# EAGLE design reflowserial (EAGLE 7.6.0)
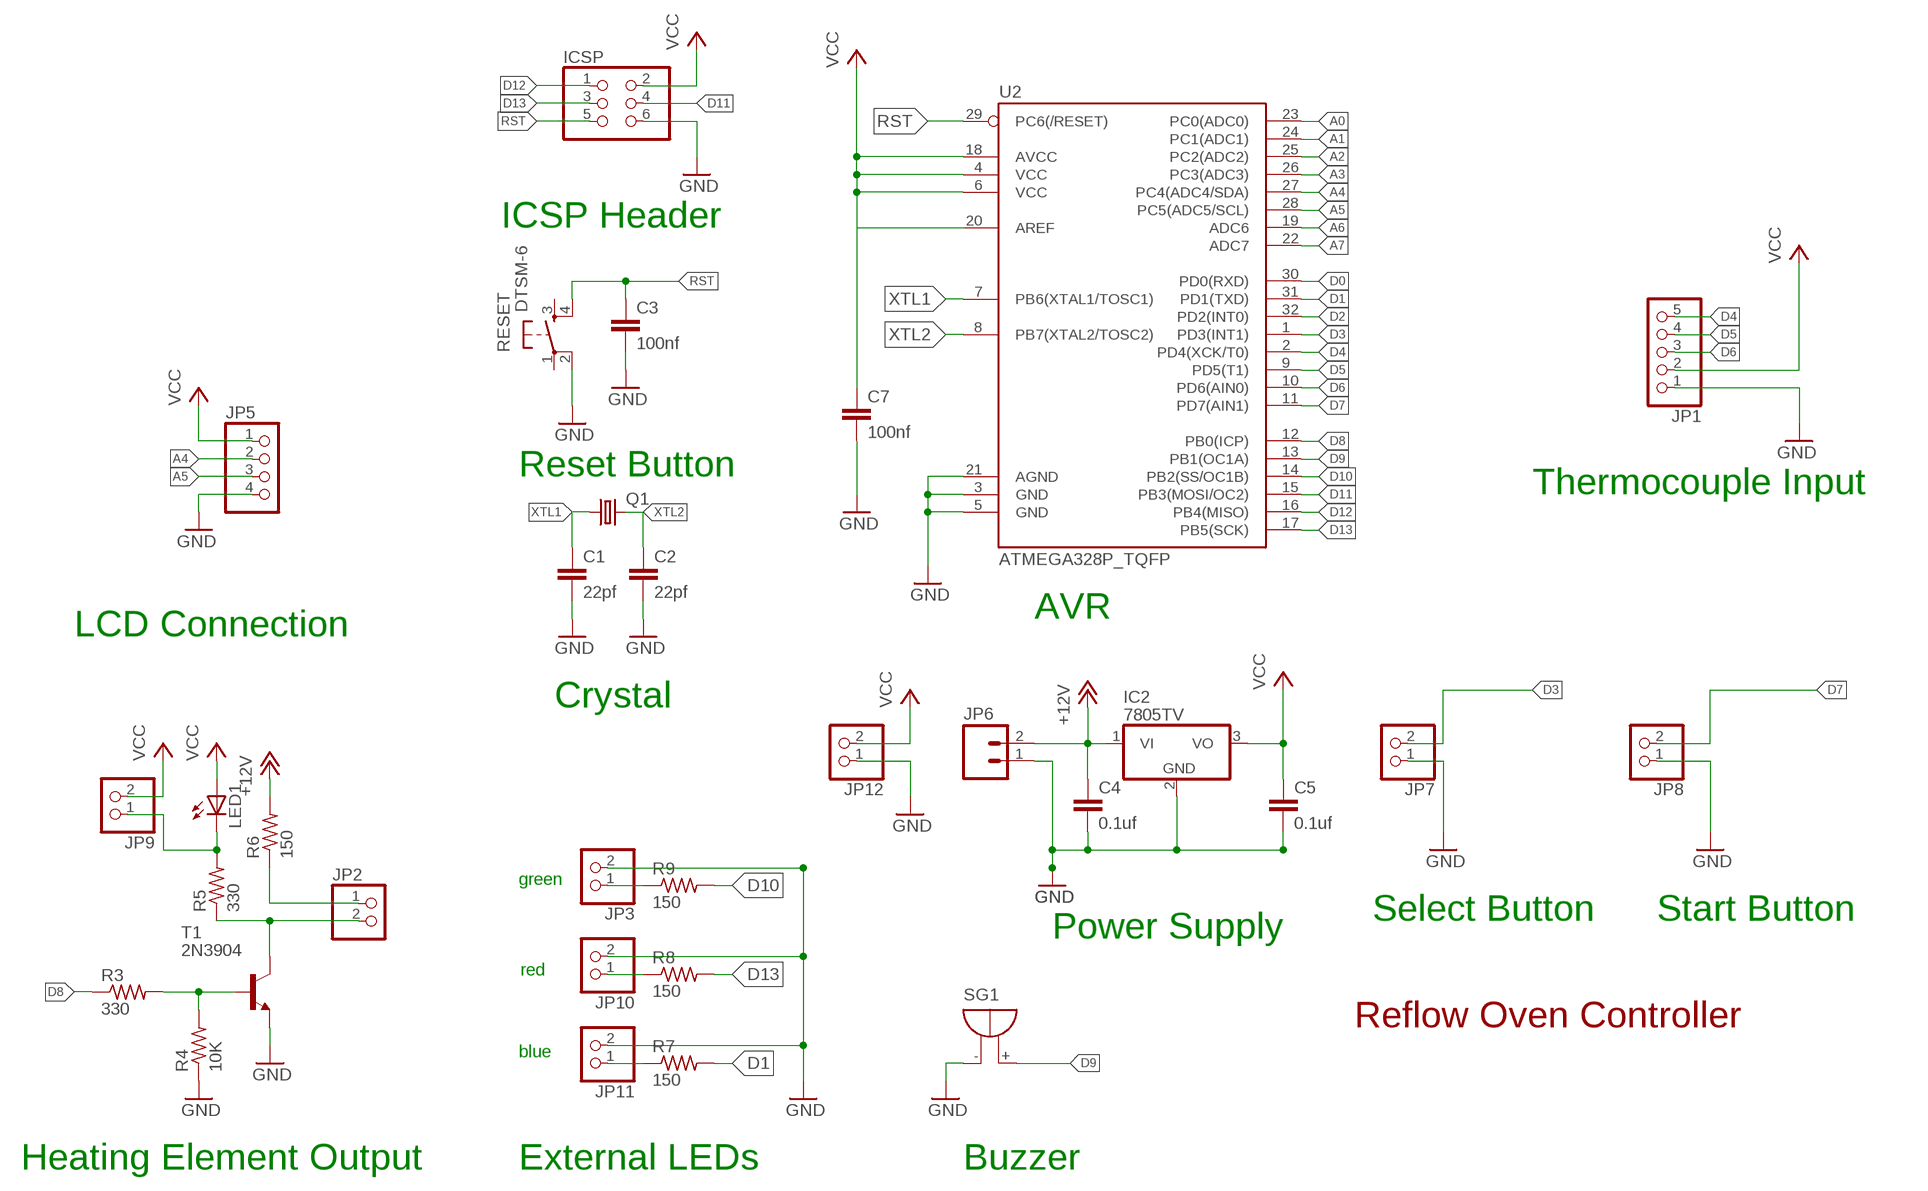
[diagram p0: schematic, sheet 1]

## Parts
C1  22pf  C-EUC0805  [C0805]
C2  22pf  C-EUC0805  [C0805]
C3  100nf  C-EUC0805  [C0805]
C4  0.1uf  C-EUC0805  [C0805]
C5  0.1uf  C-EUC0805  [C0805]
C7  100nf  C-EUC0805  [C0805]
IC2  7805TV  [TO220V]
ICSP  PINHD-2X3  [2X03]
JP1  PINHD-1X5  [1X05]
JP2  PINHD-1X2  [1X02]
JP3  PINHD-1X2  [1X02]
JP5  PINHD-1X4  [1X04]
JP6  M023.5MM  [SCREWTERMINAL-3.5MM-2]
JP7  PINHD-1X2  [1X02]
JP8  PINHD-1X2  [1X02]
JP9  PINHD-1X2  [1X02]
JP10  PINHD-1X2  [1X02]
JP11  PINHD-1X2  [1X02]
JP12  PINHD-1X2  [1X02]
LED1  LEDSMT1206  [1206]
Q1  CRYSTALSM49  [SM49]
R3  330  R-US_R0805  [R0805]
R4  10K  R-US_R0805  [R0805]
R5  330  R-US_R0805  [R0805]
R6  150  R-US_R0805  [R0805]
R7  150  R-US_R0805  [R0805]
R8  150  R-US_R0805  [R0805]
R9  150  R-US_R0805  [R0805]
RESET  DTSM-6  [DTSM-6]
SG1  F/QMBIII  [F/QMBIII]
T1  2N3904  [TO92@1]
U2  ATMEGA328P_TQFP  [TQFP32-08]

## Nets
+12V: C4.1 IC2.1(VI) JP6.2 R6.2
A0: U2.23(PC0(ADC0))
A1: U2.24(PC1(ADC1))
A2: U2.25(PC2(ADC2))
A3: U2.26(PC3(ADC3))
A4: JP5.2 U2.27(PC4(ADC4/SDA))
A5: JP5.3 U2.28(PC5(ADC5/SCL))
A6: U2.19(ADC6)
A7: U2.22(ADC7)
D0: U2.30(PD0(RXD))
D1: R7.2 U2.31(PD1(TXD))
D2: U2.32(PD2(INT0))
D3: JP7.2 U2.1(PD3(INT1))
D4: JP1.5 U2.2(PD4(XCK/T0))
D5: JP1.4 U2.9(PD5(T1))
D6: JP1.3 U2.10(PD6(AIN0))
D7: JP8.2 U2.11(PD7(AIN1))
D8: R3.1 U2.12(PB0(ICP))
D9: SG1.+(-) U2.13(PB1(OC1A))
D10: R9.2 U2.14(PB2(SS/OC1B))
D11: ICSP.4 U2.15(PB3(MOSI/OC2))
D12: ICSP.1 U2.16(PB4(MISO))
D13: ICSP.3 R8.2 U2.17(PB5(SCK))
GND: C1.2 C2.2 C3.2 C4.2 C5.2 C7.2 IC2.2(GND) ICSP.6 JP1.1 JP3.2 JP5.4 JP6.1 JP7.1 JP8.1 JP10.2 JP11.2 JP12.1 R4.1 RESET.2 SG1.-(+) T1.3(E) U2.3(GND) U2.5(GND) U2.21(AGND)
N$1: JP3.1 R9.1
N$2: R3.2 R4.2 T1.2(B)
N$3: JP2.2 R5.1 T1.1(C)
N$4: JP10.1 R8.1
N$5: JP11.1 R7.1
N$6: JP9.1 LED1.C R5.2
N$7: JP2.1 R6.1
RST: C3.1 ICSP.5 RESET.4 U2.29(PC6(/RESET))
VCC: C5.1 C7.1 IC2.3(VO) ICSP.2 JP1.2 JP5.1 JP9.2 JP12.2 LED1.A U2.4(VCC) U2.6(VCC) U2.18(AVCC) U2.20(AREF)
XTL1: C1.1 Q1.1 U2.7(PB6(XTAL1/TOSC1))
XTL2: C2.1 Q1.2 U2.8(PB7(XTAL2/TOSC2))
Unconnected: RESET.1 RESET.3

## Notes on the sheet
- ICSP Header
- Reset Button
- Thermocouple Input
- AVR
- LCD Connection
- Crystal
- green
- Select Button | Start Button
- Power Supply
- red
- Reflow Oven Controller
- blue
- Heating Element Output | External LEDs | Buzzer

## Library data of the parts
C1-C5 C7 = resistor:C-EU: CAPACITOR, European symbol
IC2 = linear:78*: Positive VOLTAGE REGULATOR Source: http://cache.national.com/ds/LM/LM78L05.pdf http://www.fairchildsemi.com/ds/LM/LM7805.pdf
ICSP = pinhead:PINHD-2X3: PIN HEADER
JP1 = pinhead:PINHD-1X5: PIN HEADER
JP2 JP3 JP7-JP12 = pinhead:PINHD-1X2: PIN HEADER
JP5 = pinhead:PINHD-1X4: PIN HEADER
JP6 = SparkFun-Connectors:M02: Standard 2-pin 0.1" header. Use with - straight break away headers ( PRT-00116) - right angle break away headers (PRT-00553) - swiss pins (PRT-00743) - machine pins (PRT-00117) - female headers (PRT-00115) Molex polarized connector foot print use with: PRT-08233 with associated crimp pins and housings. 2.54_SCREWTERM for use with PRT-10571. 3.5mm Screw Terminal footprints for PRT-08084 5mm Screw Terminal footprints for use with PRT-08433
LED1 = led:LED: LED OSRAM: - CHIPLED LG R971, LG N971, LY N971, LG Q971, LY Q971, LO R971, LY R971 LH N974, LH R974 LS Q976, LO Q976, LY Q976 LO Q996 - Hyper CHIPLED LW Q18S LB Q993, LB Q99A, LB R99A - SideLED LS A670, LO A670, LY A670, LG A670, LP A670 LB A673, LV A673, LT A673, LW A673 LH A674 LY A675 LS A676, LA A676, LO A676, LY A676, LW A676 LS A679, LY A679, LG A679 - Hyper Micro SIDELED® LS Y876, LA Y876, LO Y876, LY Y876 LT Y87S - SmartLED LW L88C, LW L88S LB L89C, LB L89S, LG L890 LS L89K, LO L89K, LY L89K LS L896, LA L896, LO L896, LY L896 - TOPLED LS T670, LO T670, LY T670, LG T670, LP T670 LSG T670, LSP T670, LSY T670, LOP T670, LYG T670 LG T671, LOG T671, LSG T671 LB T673, LV T673, LT T673, LW T673 LH T674 LS T676, LA T676, LO T676, LY T676, LB T676, LH T676, LSB T676, LW T676 LB T67C, LV T67C, LT T67C, LS T67K, LO T67K, LY T67K, LW E67C LS E67B, LA E67B, LO E67B, LY E67B, LB E67C, LV E67C, LT E67C LW T67C LS T679, LY T679, LG T679 LS T770, LO T770, LY T770, LG T770, LP T770 LB T773, LV T773, LT T773, LW T773 LH T774 LS E675, LA E675, LY E675, LS T675 LS T776, LA T776, LO T776, LY T776, LB T776 LHGB T686 LT T68C, LB T68C - Hyper Mini TOPLED® LB M676 - Mini TOPLED Santana® LG M470 LS M47K, LO M47K, LY M47K Source: http://www.osram.convergy.de LUXEON: - LUMILED® LXK2-PW12-R00, LXK2-PW12-S00, LXK2-PW14-U00, LXK2-PW14-V00 LXK2-PM12-R00, LXK2-PM12-S00, LXK2-PM14-U00 LXK2-PE12-Q00, LXK2-PE12-R00, LXK2-PE12-S00, LXK2-PE14-T00, LXK2-PE14-U00 LXK2-PB12-K00, LXK2-PB12-L00, LXK2-PB12-M00, LXK2-PB14-N00, LXK2-PB14-P00, LXK2-PB14-Q00 LXK2-PR12-L00, LXK2-PR12-M00, LXK2-PR14-Q00, LXK2-PR14-R00 LXK2-PD12-Q00, LXK2-PD12-R00, LXK2-PD12-S00 LXK2-PH12-R00, LXK2-PH12-S00 LXK2-PL12-P00, LXK2-PL12-Q00, LXK2-PL12-R00 Source: www.luxeon.com KINGBRIGHT: KA-3528ASYC Source: www.kingbright.com
Q1 = crystal:CRYSTAL: CRYSTAL; OC_FARNELL: unknown; OC_NEWARK: unknown
R3-R9 = resistor:R-US_: RESISTOR, American symbol
RESET = switch-tact:DTSM-6
SG1 = buzzer:F/QMBIII: BUZZER Source: Buerklin; OC_FARNELL: unknown; OC_NEWARK: unknown
T1 = transistor:2N3904: NPN TRANSISTOR
U2 = SparkFun-DigitalIC:ATMEGA328P_TQFP; PROD_ID: IC-09069

## Board
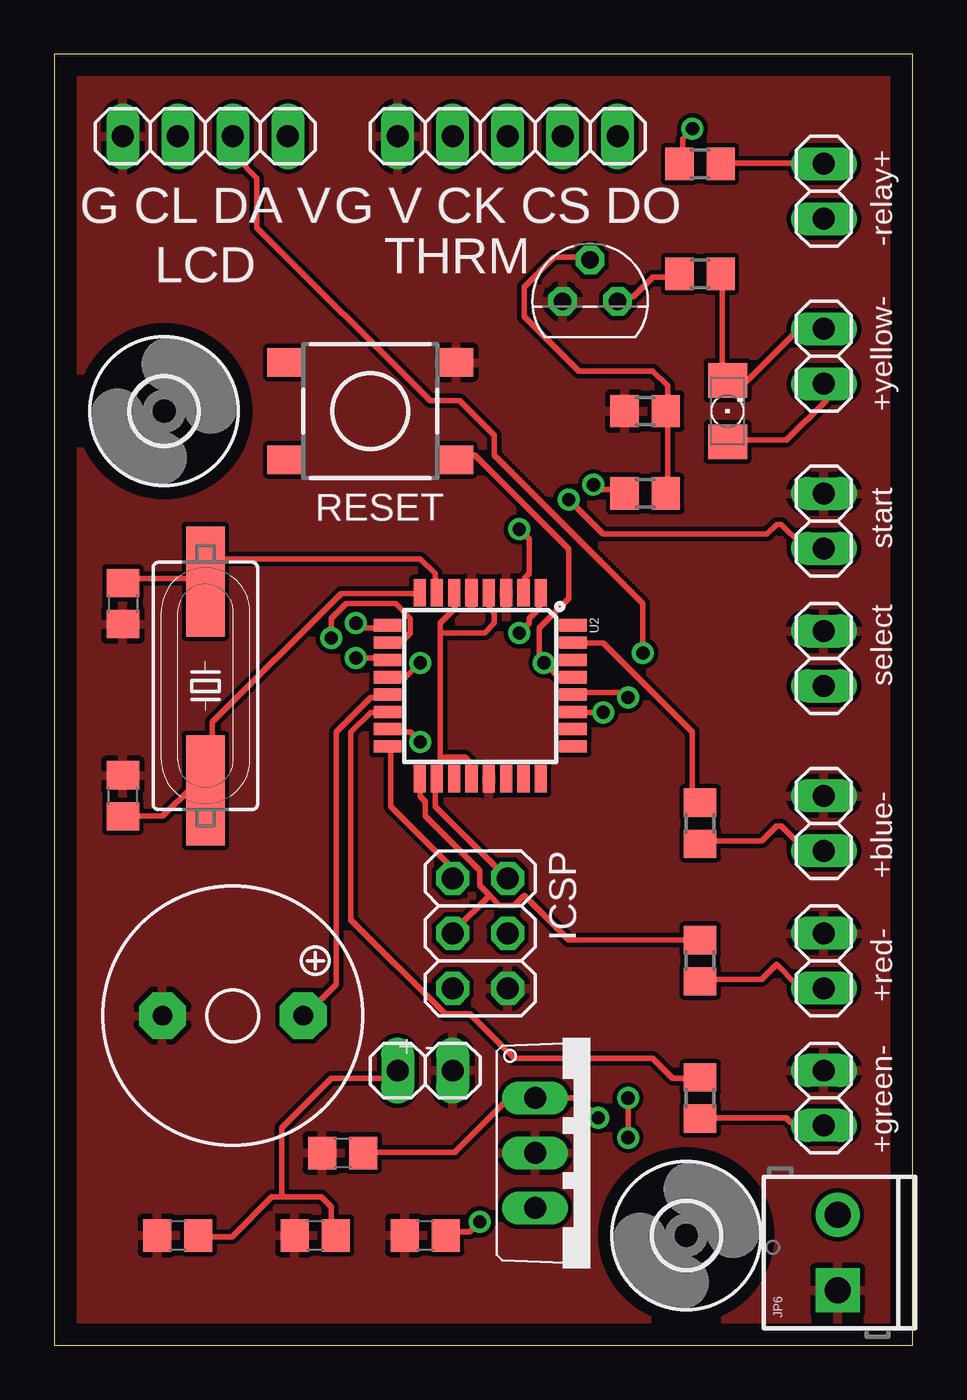
[diagram p1: board, top side]
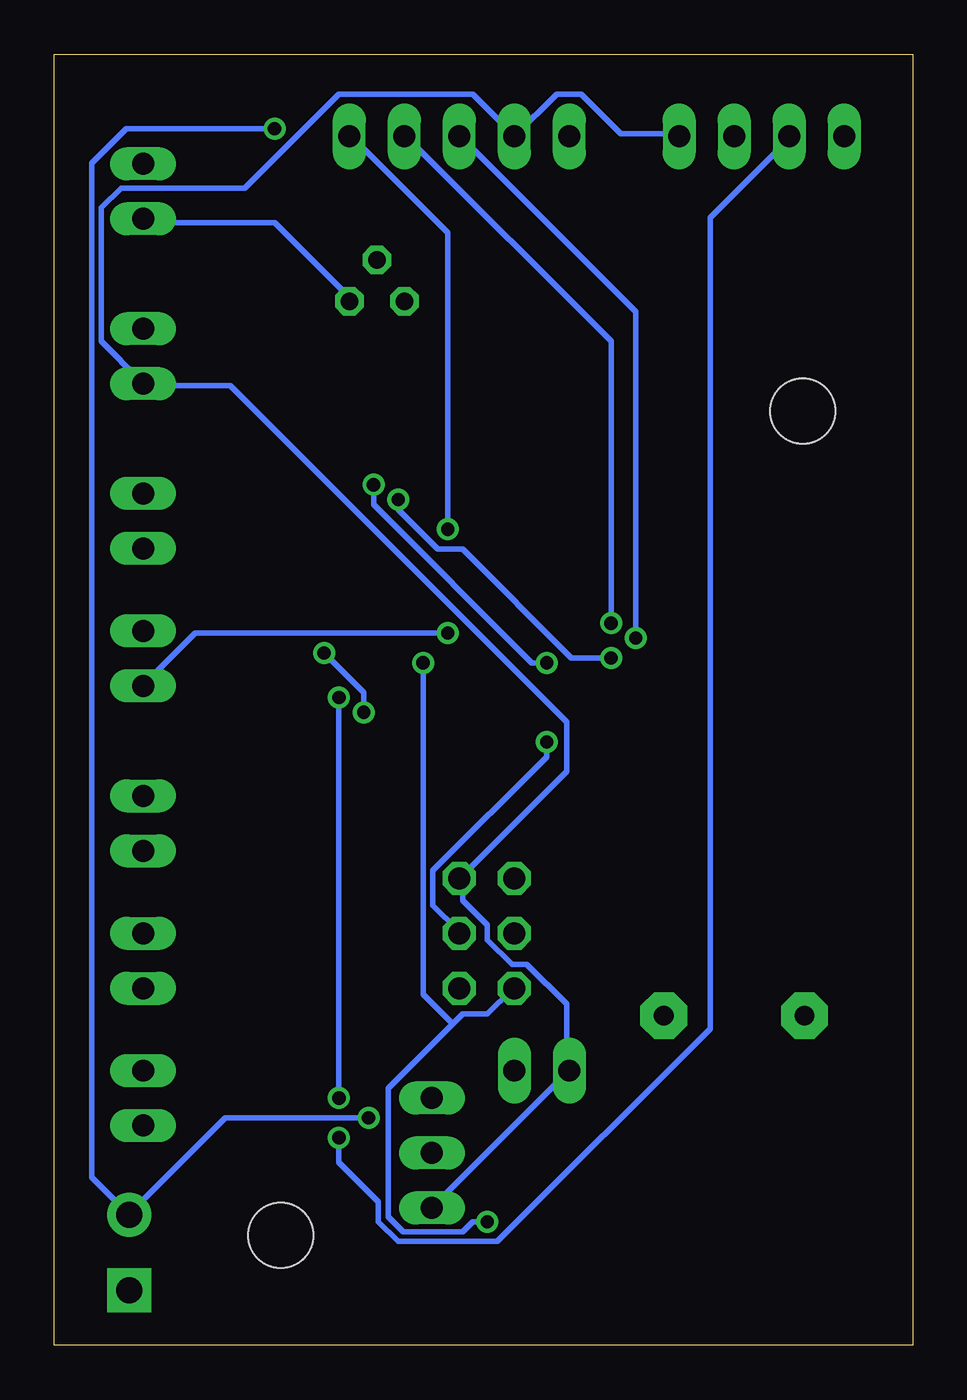
[diagram p2: board, bottom side, seen from below]

Size 39.67 x 59.68 mm. Coordinates in mm from the lower left corner, seen from the top.
Outline: 0,0 39.67,0 39.67,59.68 0,59.68 0,0
Copper layers (1*16): Top 0.035mm / dielectric 1.5mm / Bottom 0.035mm
Design rules "default": minimum track width 10mil, minimum drill 24mil, track to track 8mil, track to pad 8mil, pad to pad 8mil, via to via 8mil, smd to smd 8mil, copper to edge 40mil, drill to drill 8mil, minimum pad ring 10mil, minimum via ring 8mil, stop-mask expansion 4mil, vias tented up to drill 0mil, thermal gap 10mil

### Footprints (pad centres in the part's own frame; a part is rotated, then mirrored left to right if it is on the bottom)
C0805 = smd 1.3 x 1.5: 1 -0.95,0; 2 0.95,0
TO220V = drill 1.016 long: 1 -2.54,-2.54; 2 0,-2.54; 3 2.54,-2.54
2X03 = drill 1.016 octagon: 1 -2.54,-1.27; 2 -2.54,1.27; 3 0,-1.27; 4 0,1.27; 5 2.54,-1.27; 6 2.54,1.27
1X05 = drill 1.016 long: 1 -5.08,0; 2 -2.54,0; 3 0,0; 4 2.54,0; 5 5.08,0
1X02 = drill 1.016 long: 1 -1.27,0; 2 1.27,0
1X04 = drill 1.016 long: 1 -3.81,0; 2 -1.27,0; 3 1.27,0; 4 3.81,0
SCREWTERMINAL-3.5MM-2 = drill 1.2 pad 2.032 square: 1 0,0 | drill 1.2 pad 2.032: 2 3.5,0
1206 = smd 1.6 x 1.803: A -1.422,0; C 1.422,0
SM49 = smd 5.08 x 1.778: 1 -4.826,0; 2 4.826,0
R0805 = smd 1.3 x 1.5: 1 -0.95,0; 2 0.95,0
DTSM-6 = smd 1.55 x 1.3: 1 -3.975,2.25; 2 3.975,2.25; 3 -3.975,-2.25; 4 3.975,-2.25
F/QMBIII = drill 0.914 pad 2.159 octagon: + 3.251,0; - -3.251,0
TO92@1 = drill 0.813 octagon: 1 1.27,0; 2 0,1.905; 3 -1.27,0
TQFP32-08 = smd 1.27 x 0.559: 1 -4.293,2.8; 2 -4.293,2; 3 -4.293,1.2; 4 -4.293,0.4; 5 -4.293,-0.4; 6 -4.293,-1.2; 7 -4.293,-2; 8 -4.293,-2.8; 17 4.293,-2.8; 18 4.293,-2; 19 4.293,-1.2; 20 4.293,-0.4; 21 4.293,0.4; 22 4.293,1.2; 23 4.293,2; 24 4.293,2.8 | smd 0.559 x 1.27: 9 -2.8,-4.293; 10 -2,-4.293; 11 -1.2,-4.293; 12 -0.4,-4.293; 13 0.4,-4.293; 14 1.2,-4.293; 15 2,-4.293; 16 2.8,-4.293; 25 2.8,4.293; 26 2,4.293; 27 1.2,4.293; 28 0.4,4.293; 29 -0.4,4.293; 30 -1.2,4.293; 31 -2,4.293; 32 -2.8,4.293
3,0 = hole 3: 0,0

### Placement (x,y rotation side)
C1  3.17,34.29 270 top
C2  3.17,25.4 90 top
C3  17.14,5.08 180 top
C4  13.34,8.89 180 top
C5  5.71,5.08 180 top
C7  12.06,5.08 180 top
IC2  24.77,8.89 270 top
ICSP  19.68,19.05 270 top
JP1  20.95,55.88 0 top
JP2  35.56,53.34 270 top
JP3  35.56,11.43 90 top
JP5  6.99,55.88 180 top
JP6  36.2,2.54 90 top
JP7  35.56,31.75 270 top
JP8  35.56,38.1 270 top
JP9  35.56,45.72 270 top
JP10  35.56,17.78 90 top
JP11  35.56,24.13 90 top
JP12  17.14,12.7 180 top
LED1  31.11,43.18 90 top
Q1  6.99,30.48 270 top
R3  27.3,39.37 0 top
R4  27.3,43.18 0 top
R5  29.84,49.53 0 top
R6  29.84,54.61 180 top
R7  29.84,24.13 90 top
R8  29.84,17.78 90 top
R9  29.84,11.43 90 top
RESET  14.61,43.18 0 top
SG1  8.26,15.24 0 top
T1  24.77,48.26 0 top
U2  19.68,30.48 270 top
U$1  [3,0]  5.08,43.18 0 top
U$2  [3,0]  29.21,5.08 0 top

### Tracks (layer width: path | path; a pad name or v marks a point on that pad's centre or on a via)
+12V  (via drill 0.61)
  Top 0.254: C4.1 14.4,8.91 18.52,8.91 21.03,11.43 IC2.1 24.23,11.43 v25.15,10.52 | v29.49,56.24 29.03,55.78 29.03,54.63 R6.2
  Bottom 0.254: v29.49,56.24 36.35,56.24 37.95,54.63 37.95,7.77 36.35,6.17 JP6.2 36.12,6.17 31.77,10.52 v25.15,10.52
A4  (via drill 0.61)
  Top 0.254: v25.38,29.26 24,29.26 U2.27 | v27.2,32 27.2,34.29 20.34,41.15 20.34,42.06 18.75,43.66 17.37,43.66 9.37,51.66 9.37,53.95 8.46,54.86 8.46,55.78 JP5.2
  Bottom 0.254: v25.38,29.26 25.38,30.18 v27.2,32
A5  (via drill 0.61)
  Top 0.254: v26.52,29.95 26.29,30.18 24,30.18 U2.28 | v26.52,9.6 v26.52,11.43
  Bottom 0.254: v26.52,11.43 v26.52,29.95 | v26.52,9.6 26.52,8.46 24.69,6.63 24.69,5.71 23.77,4.8 19.2,4.8 9.37,14.63 9.37,52.12 5.71,55.78 JP5.3
D1
  Top 0.254: U2.31 24,32.46 25.38,32.46 29.49,28.35 29.49,25.38 29.72,25.15 R7.2
D3  (via drill 0.61)
  Top 0.254: v21.49,32.92 21.95,33.38 21.95,33.6 22.4,34.06 22.4,34.75 U2.1
  Bottom 0.254: v21.49,32.92 33.15,32.92 35.43,30.63 JP7.2
D4  (via drill 0.61)
  Top 0.254: v21.49,37.72 21.95,37.26 21.95,35.66 21.72,35.43 21.72,34.98 U2.2
  Bottom 0.254: v21.49,37.72 21.49,51.44 25.83,55.78 JP1.5
D5  (via drill 0.61)
  Top 0.254: v13.95,33.38 14.17,33.15 15.32,33.15 U2.9
  Bottom 0.254: v13.95,33.38 13.95,46.41 23.32,55.78 JP1.4
D6  (via drill 0.61)
  Top 0.254: v12.8,32.69 12.8,33.6 13.49,34.29 15.77,34.29 16.46,33.6 16.46,32.92 16,32.46 15.54,32.46 U2.10
  Bottom 0.254: v12.8,32.69 12.8,47.78 20.8,55.78 JP1.3
D7  (via drill 0.61)
  Top 0.254: v13.95,31.77 15.32,31.77 U2.11 | v23.77,39.09 25.38,37.49 32.92,37.49 33.38,37.95 33.6,37.95 34.52,37.03 35.43,37.03 JP8.2
  Bottom 0.254: v13.95,31.77 15.77,31.77 20.8,36.8 21.95,36.8 23.77,38.63 v23.77,39.09
D8  (via drill 0.61)
  Top 0.254: v16.92,31.55 16.23,30.86 15.54,30.86 U2.12 | v24.92,39.78 25.15,39.55 26.29,39.55 R3.1
  Bottom 0.254: v16.92,31.55 17.6,31.55 24.92,38.86 v24.92,39.78
D9
  Top 0.254: U2.13 15.32,29.95 14.63,29.95 13.03,28.35 13.03,16.69 11.66,15.32 SG1.+
D10
  Top 0.254: U2.14 15.32,29.26 14.63,29.26 13.72,28.35 13.72,19.66 18.06,15.32 19.2,15.32 21.26,13.26 27.66,13.26 28.57,12.34 29.72,12.34 R9.2
D11  (via drill 0.61)
  Top 0.254: v16.92,27.89 16.46,28.35 15.54,28.35 U2.15
  Bottom 0.254: v16.92,27.89 16.92,27.2 22.17,21.95 22.17,20.34 21.03,19.2 ICSP.4
D12
  Top 0.254: U2.16 15.54,27.66 15.54,24.92 18.29,22.17 18.29,21.72 ICSP.1
D13
  Top 0.254: 20.12,20.8 19.66,21.26 19.66,21.95 17.14,24.46 17.14,25.15 16.92,25.38 16.92,26.06 U2.17 | 20.12,20.8 18.52,19.2 ICSP.3 | 20.12,20.8 20.57,20.34 21.26,20.34 21.72,20.8 23.77,18.75 29.72,18.75 R8.2
GND
  pour Top: -1.27,0 -1.27,80.01 101.6,80.01 101.6,0
N$1
  Top 0.254: R9.1 29.95,10.52 33.83,10.52 34.06,10.29 35.43,10.29 JP3.1
N$2
  Top 0.254: R3.2 28.35,39.55 28.35,42.98 R4.2 28.35,43.2 28.35,44.35 27.66,45.03 24.23,45.03 21.72,47.55 21.72,48.92 23.09,50.29 24.69,50.29 T1.2
N$3
  Top 0.254: R5.1 28.8,49.38 27.66,49.38 26.75,48.46 26.06,48.46 T1.1
  Bottom 0.254: JP2.2 35.43,51.89 29.49,51.89 26.06,48.46 T1.1
N$4
  Top 0.254: R8.1 29.95,16.92 32.69,16.92 33.38,17.6 34.29,16.69 35.43,16.69 JP10.1
N$5
  Top 0.254: JP11.1 34.75,22.86 33.6,24 33.38,24 32.69,23.32 29.95,23.32 R7.1
N$6
  Top 0.254: R5.2 30.86,49.38 30.86,45.03 31.09,44.81 LED1.C 31.32,44.58 32,44.58 34.29,46.86 35.43,46.86 JP9.1
N$7
  Top 0.254: R6.1 30.86,54.63 35.43,54.63 JP2.1
RST  (via drill 0.61)
  Top 0.254: U2.29 23.77,30.86 23.32,30.86 v22.63,31.55 22.4,31.77 22.4,33.15 23.77,34.52 23.77,36.8 19.43,41.15 18.75,41.15 RESET.4 | v19.66,5.71 19.2,5.26 18.29,5.26 C3.1
  Bottom 0.254: v19.66,5.71 20.34,5.71 20.8,5.26 23.55,5.26 24.23,5.94 24.23,11.89 21.26,14.86 | 21.26,14.86 20.8,15.32 19.66,15.32 18.52,16.46 ICSP.5 | v22.63,31.55 22.63,16.23 21.26,14.86
VCC
  Top 0.254: LED1.A 31.32,41.83 33.83,41.83 35.66,43.66 35.66,44.35 JP9.2 | 17.83,26.98 17.83,26.29 U2.18 17.6,26.06 17.6,24.92 20.8,21.72 ICSP.2 | 17.83,26.98 18.06,27.2 18.97,27.2 19.2,26.98 19.2,26.29 U2.20 | 17.83,26.98 17.83,32.92 | 17.83,32.92 17.83,33.38 18.52,34.06 18.52,34.75 U2.6 | 17.83,32.92 19.89,32.92 20.34,33.38 20.34,33.83 20.12,34.06 20.12,34.75 U2.4 | 10.52,6.86 12.34,6.86 12.8,6.4 12.8,5.26 C7.1 | 10.52,6.86 10.06,6.86 8.23,5.03 6.86,5.03 C5.1 | 10.52,6.86 10.52,10.06 12.8,12.34 15.54,12.34 15.77,12.57 JP12.2
  Bottom 0.254: JP5.1 10.97,56.01 13.49,56.01 15.32,57.84 16.46,57.84 JP1.2 18.52,56.01 20.34,57.84 26.52,57.84 30.86,53.49 36.58,53.49 37.49,52.58 37.49,46.41 35.66,44.58 JP9.2 35.43,44.35 31.55,44.35 16,28.8 16,26.52 20.8,21.72 ICSP.2 20.8,21.49 20.8,20.57 19.66,19.43 19.66,18.75 18.52,17.6 17.83,17.6 16,15.77 16,12.8 JP12.2 IC2.3
XTL1
  Top 0.254: 6.86,35.43 7.77,36.35 16.92,36.35 17.6,35.66 17.6,34.98 U2.7 | 6.86,35.43 3.2,35.43 C1.1 | 6.86,35.43 Q1.1
XTL2
  Top 0.254: U2.8 16.69,34.75 13.26,34.75 7.32,28.8 7.32,26.06 7.09,25.83 Q1.2 6.86,25.83 6.4,25.83 5.03,24.46 3.2,24.46 C2.1

### Text on the board
tNames: G CL DA V | G V CK CS DO | LCD | -relay+ | THRM | +yellow- | start | select | +blue- | +red- | + - | +green-